# EAGLE design 0219-carrier-for-0119-m328p (EAGLE 9.6.2)
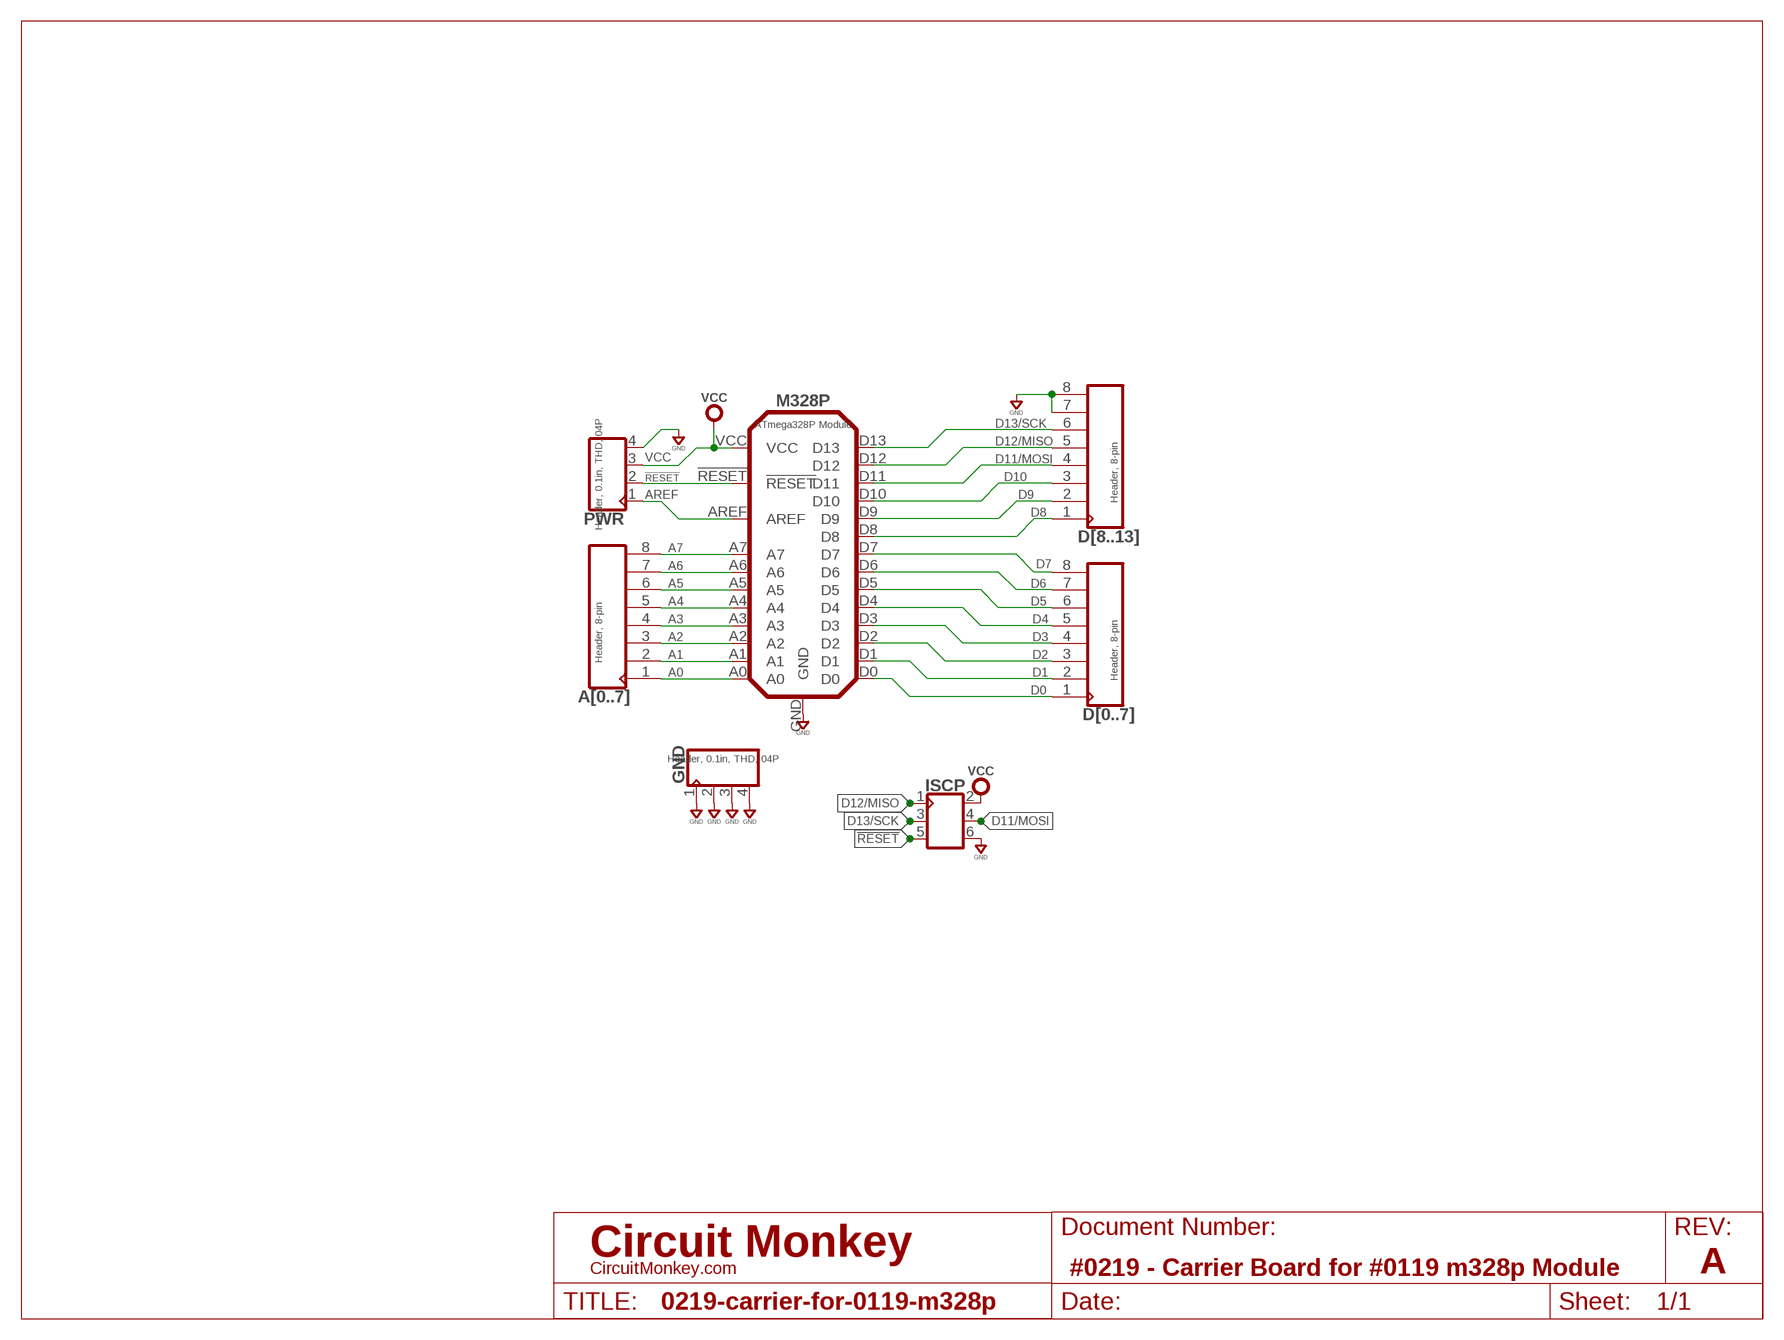
[diagram p0: schematic, sheet 1]
SHEET1 (LETTER_L-CIRCUITMONKEY): DOCUMENT_NUMBER: #0219 - Carrier Board for #0119 m328p Module; REV: A

## Parts
A[0..7]  Header, 8-pin  CON_08X1-VT-THD  [MA08X1-VT-THD]
D[0..7]  Header, 8-pin  CON_08X1-VT-THD  [MA08X1-VT-THD]
D[8..13]  Header, 8-pin  CON_08X1-VT-THD  [MA08X1-VT-THD]
GND  Header, 0.1in, THD, 04P  CON_04X1-THD-VT  [MA04X1-VT-THD]
ISCP  CON_03X2-VT_SMD  [MA03X2-VT-SMD]
M328P  ATmega328P Module  0119REV-A  [0119A]
PWR  Header, 0.1in, THD, 04P  CON_04X1-THD-VT  [MA04X1-VT-THD]

## Nets
!RESET: ISCP.5 M328P.!RESET PWR.2
A0: A[0..7].1 M328P.A0
A1: A[0..7].2 M328P.A1
A2: A[0..7].3 M328P.A2
A3: A[0..7].4 M328P.A3
A4: A[0..7].5 M328P.A4
A5: A[0..7].6 M328P.A5
A6: A[0..7].7 M328P.A6
A7: A[0..7].8 M328P.A7
AREF: M328P.AREF PWR.1
D0: D[0..7].1 M328P.D0
D1: D[0..7].2 M328P.D1
D2: D[0..7].3 M328P.D2
D3: D[0..7].4 M328P.D3
D4: D[0..7].5 M328P.D4
D5: D[0..7].6 M328P.D5
D6: D[0..7].7 M328P.D6
D7: D[0..7].8 M328P.D7
D8: D[8..13].1 M328P.D8
D9: D[8..13].2 M328P.D9
D10: D[8..13].3 M328P.D10
D11/MOSI: D[8..13].4 ISCP.4 M328P.D11
D12/MISO: D[8..13].5 ISCP.1 M328P.D12
D13/SCK: D[8..13].6 ISCP.3 M328P.D13
GND: D[8..13].7 D[8..13].8 GND.1 GND.2 GND.3 GND.4 ISCP.6 M328P.GND PWR.4
VCC: ISCP.2 M328P.VCC PWR.3

## Library data of the parts
A[0..7] D[0..7] D[8..13] = con-headers:CON_08X1: Header, 8-pin, 1-row, 2.54mm; COST01: 0.14
GND PWR = con-headers:CON_04X1: Headers, 04 pin; MFR: Molex; MPN: 022284043
ISCP = con-headers:CON_03X2: Header, 3x2 (6-pin)
M328P = circuit-monkey-chips:0119: Circuit Monkey #0119 - ATmega328P Module; MFR: Circuit Monkey; MPN: 0119A

## Board
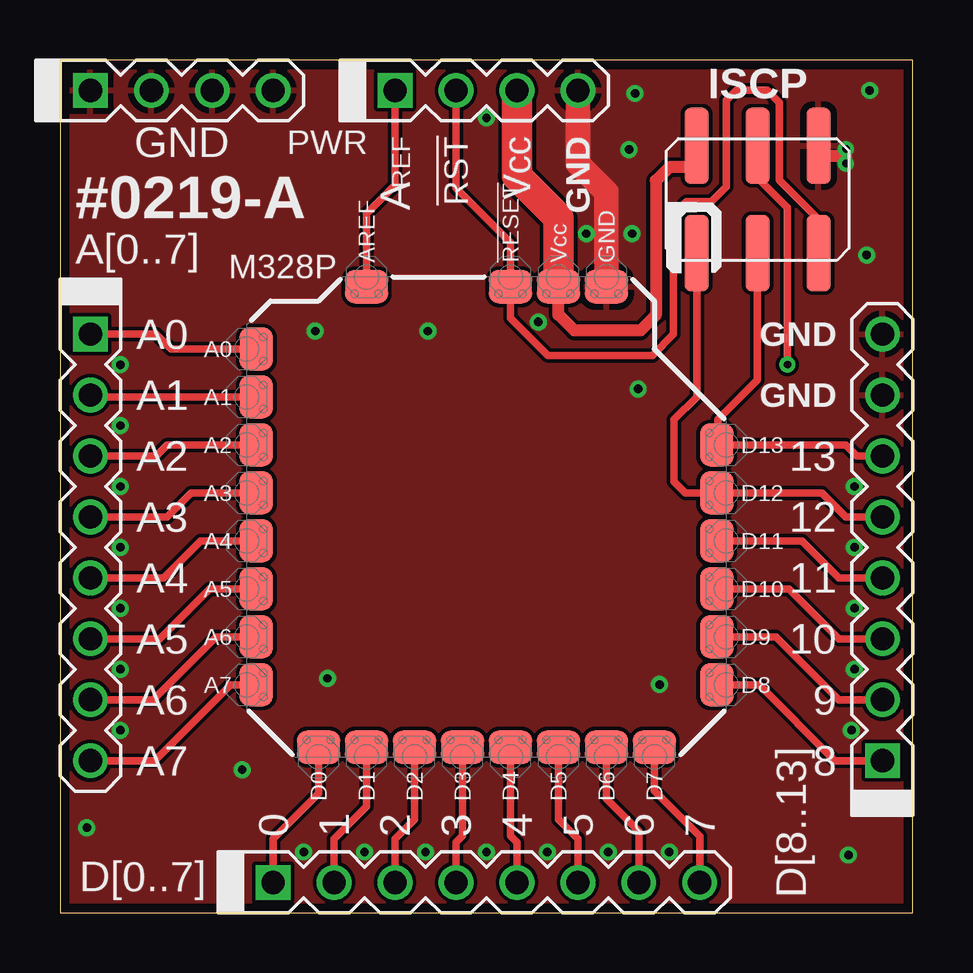
[diagram p1: board, top side]
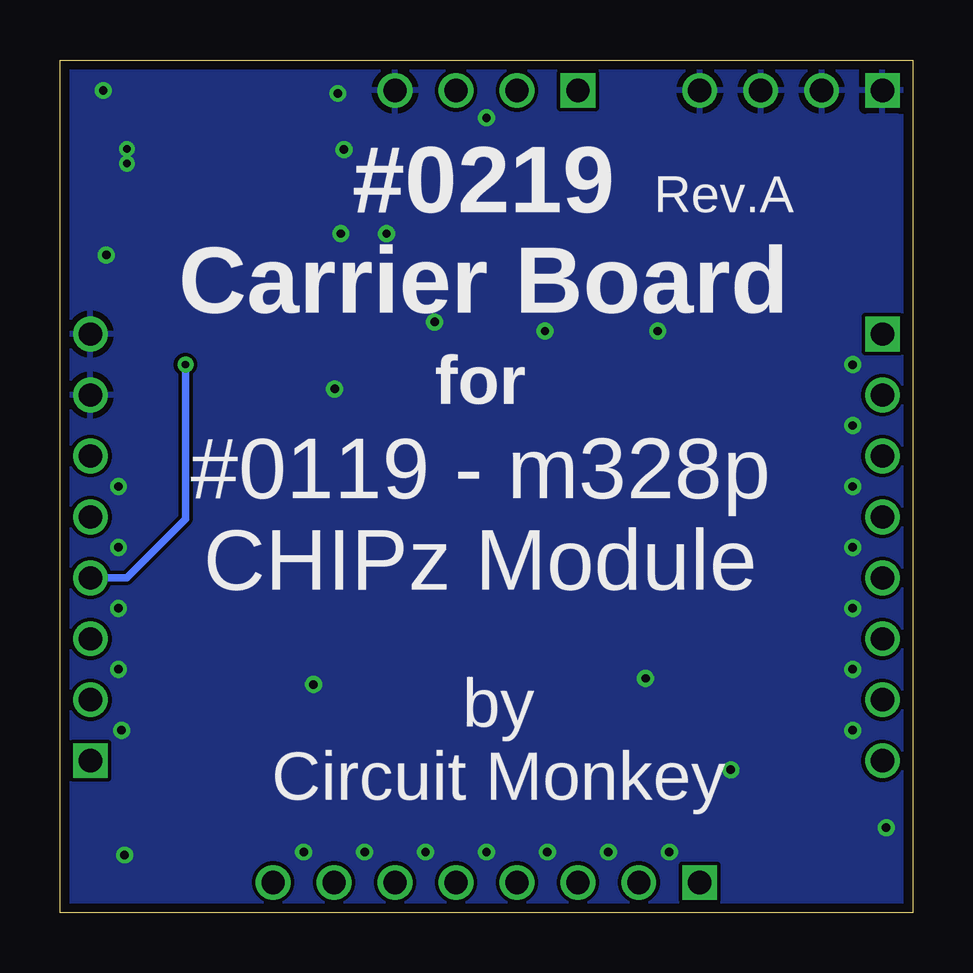
[diagram p2: board, bottom side, seen from below]

Size 35.56 x 35.56 mm. Coordinates in mm from the lower left corner, seen from the top.
Outline: 0,0 35.56,0 35.56,35.56 0,35.56 0,0
Copper layers (1*16): Top 0.0356mm / dielectric 1.5011mm / Bottom 0.0356mm
Design rules "OSH-CircuitMonkey *": minimum track width 6mil, minimum drill 12mil, track to track 6mil, track to pad 6mil, pad to pad 6mil, via to via 6mil, smd to smd 6mil, copper to edge 15mil, drill to drill 6mil, minimum pad ring 7mil, minimum via ring 7mil, stop-mask expansion 3mil, vias tented up to drill 13mil, thermal gap 10mil

### Footprints (pad centres in the part's own frame; a part is rotated, then mirrored left to right if it is on the bottom)
MA08X1-VT-THD = drill 0.965 square: 1 -8.89,0 | drill 0.965: 2 -6.35,0; 3 -3.81,0; 4 -1.27,0; 5 1.27,0; 6 3.81,0; 7 6.35,0; 8 8.89,0
MA04X1-VT-THD = drill 0.965 square: 1 -3.81,0 | drill 0.965: 2 -1.27,0; 3 1.27,0; 4 3.81,0
MA03X2-VT-SMD = smd 1.016 x 3.175: 1 -2.54,-2.235; 2 -2.54,2.235; 3 0,-2.235; 4 0,2.235; 5 2.54,-2.235; 6 2.54,2.235
0119A = smd 1.4 x 1.8: !RESET 9.6,-1; AREF 9.6,5; D0 -9.6,7; D1 -9.6,5; D2 -9.6,3; D3 -9.6,1; D4 -9.6,-1; D5 -9.6,-3; D6 -9.6,-5; D7 -9.6,-7; GND 9.6,-5; VCC 9.6,-3 | smd 1.8 x 1.4: A0 7,9.6; A1 5,9.6; A2 3,9.6; A3 1,9.6; A4 -1,9.6; A5 -3,9.6; A6 -5,9.6; A7 -7,9.6; D8 -7,-9.6; D9 -5,-9.6; D10 -3,-9.6; D11 -1,-9.6; D12 1,-9.6; D13 3,-9.6

### Placement (x,y rotation side)
A[0..7]  1.27,15.24 270 top
D[0..7]  17.78,1.27 0 top
D[8..13]  34.29,15.24 90 top
GND  5.08,34.29 0 top
ISCP  29.08,29.74 0 top
M328P  17.78,16.51 90 top
PWR  17.78,34.29 0 top

### Tracks (layer width: path | path; a pad name or v marks a point on that pad's centre or on a via)
!RESET
  Top 0.305: PWR.2 16.51,30.21 18.78,27.94 M328P.!RESET 18.78,24.81 20.34,23.24 24.69,23.24 25.58,24.13 25.58,29.12 26.11,29.65 27.16,29.65 27.79,30.29 27.79,33.88 28.19,34.29 29.49,34.29 30,33.78 30,30.54 31.62,28.91 ISCP.5
A0
  Top 0.305: M328P.A0 4.63,23.51 4.01,24.13 A[0..7].1
A1
  Top 0.305: M328P.A1 1.35,21.51 A[0..7].2
A2
  Top 0.305: M328P.A2 4.47,19.51 4.01,19.05 A[0..7].3
A3
  Top 0.305: M328P.A3 5.47,17.51 4.47,16.51 A[0..7].4
A4
  Top 0.305: M328P.A4 5.86,15.51 4.32,13.97 A[0..7].5
A5
  Top 0.305: M328P.A5 6.25,13.51 4.17,11.43 A[0..7].6
A6
  Top 0.305: M328P.A6 6.5,11.51 3.88,8.89 A[0..7].7
A7
  Top 0.305: M328P.A7 7.11,9.51 3.95,6.35 A[0..7].8
AREF
  Top 0.305: PWR.1 13.97,30.35 12.78,29.16 M328P.AREF
D0
  Top 0.305: M328P.D0 10.78,4.99 8.89,3.1 D[0..7].1
D1
  Top 0.305: M328P.D1 12.78,4.45 11.43,3.1 D[0..7].2
D2
  Top 0.305: M328P.D2 14.78,3.91 13.97,3.1 D[0..7].3
D3
  Top 0.305: M328P.D3 16.78,3.22 16.51,2.95 D[0..7].4
D4
  Top 0.305: M328P.D4 18.78,3.22 19.05,2.95 D[0..7].5
D5
  Top 0.305: M328P.D5 20.78,3.91 21.59,3.1 D[0..7].6
D6
  Top 0.305: M328P.D6 22.78,4.75 24.13,3.4 D[0..7].7
D7
  Top 0.305: M328P.D7 24.78,5.08 26.67,3.19 D[0..7].8
D8
  Top 0.305: M328P.D8 29.15,9.51 32.31,6.35 D[8..13].1
D9
  Top 0.305: M328P.D9 29.84,11.51 32.46,8.89 D[8..13].2
D10
  Top 0.305: M328P.D10 30.38,13.51 32.46,11.43 D[8..13].3
D11/MOSI  (via drill 0.3)
  Top 0.305: M328P.D11 30.92,15.51 32.46,13.97 D[8..13].4 | ISCP.4 29.08,30.66 30.33,29.41 v30.33,22.86
  Bottom 0.305: v30.33,22.86 30.33,16.43 32.78,13.97 D[8..13].4
D12/MISO
  Top 0.305: D[8..13].5 32.77,16.51 31.77,17.51 M328P.D12 26.08,17.51 25.6,17.98 25.6,20.57 26.54,21.51 ISCP.1
D13/SCK
  Top 0.305: D[8..13].6 33.22,19.05 32.76,19.51 M328P.D13 27.43,19.56 27.43,20.57 29.08,22.23 ISCP.3
GND  (via drill 0.3, 0.35)
  Top 0.508: ISCP.6 32.05,31.55 32.77,31.55 v32.77,31.24 v32.77,31.85
  Top 1.016: M328P.GND 22.78,30.06 21.59,31.25 PWR.4
  other vias: 23.72,31.83 2.51,22.86 2.51,20.32 2.51,17.78 2.51,15.24 2.51,12.7 2.51,10.16 2.51,7.62 1.12,3.56 7.59,5.97 11.15,9.78 24.99,9.53 24.1,21.84 10.64,24.26 15.34,24.26 23.85,28.32 21.95,28.32 23.98,34.16 33.76,34.29 33.63,27.43 33.12,17.78 33.12,15.24 33.12,12.7 33.12,10.16 32.99,7.62 32.87,2.41 22.86,2.54 25.4,2.54 20.32,2.54 17.78,2.54 15.24,2.54 12.7,2.54 10.16,2.54 19.94,24.64 17.78,33.15
  pour Bottom: 0,0 0,35.56 35.56,35.56 35.56,0
  pour Top: 35.51,0 35.51,35.56 -0.05,35.56 -0.05,0
VCC
  Top 0.508: ISCP.2 26.54,31.34 26.29,31.09 25.4,31.09 24.84,30.53 24.84,24.92 24.21,24.28 21.44,24.28 20.78,24.94 M328P.VCC
  Top 1.27: M328P.VCC 20.78,28.99 19.05,30.72 PWR.3

### Text on the board
tPlace: REF | !RST | Vcc | GND | #0219-A | A | A0 | GND | A1 | GND | A2 | 13 | A3 | 12 | A4 | 11 | A5 | 10 | A6 | 9 | A7 | 8 | 0 | 1 | 2 | 3 | 4 | 5 | 6 | 7
bPlace: #0219 / Carrier Board | Rev.A | for | #0119 - m328p / CHIPz Module | by / Circuit Monkey